# Altium project PCB_Project.PrjPcb
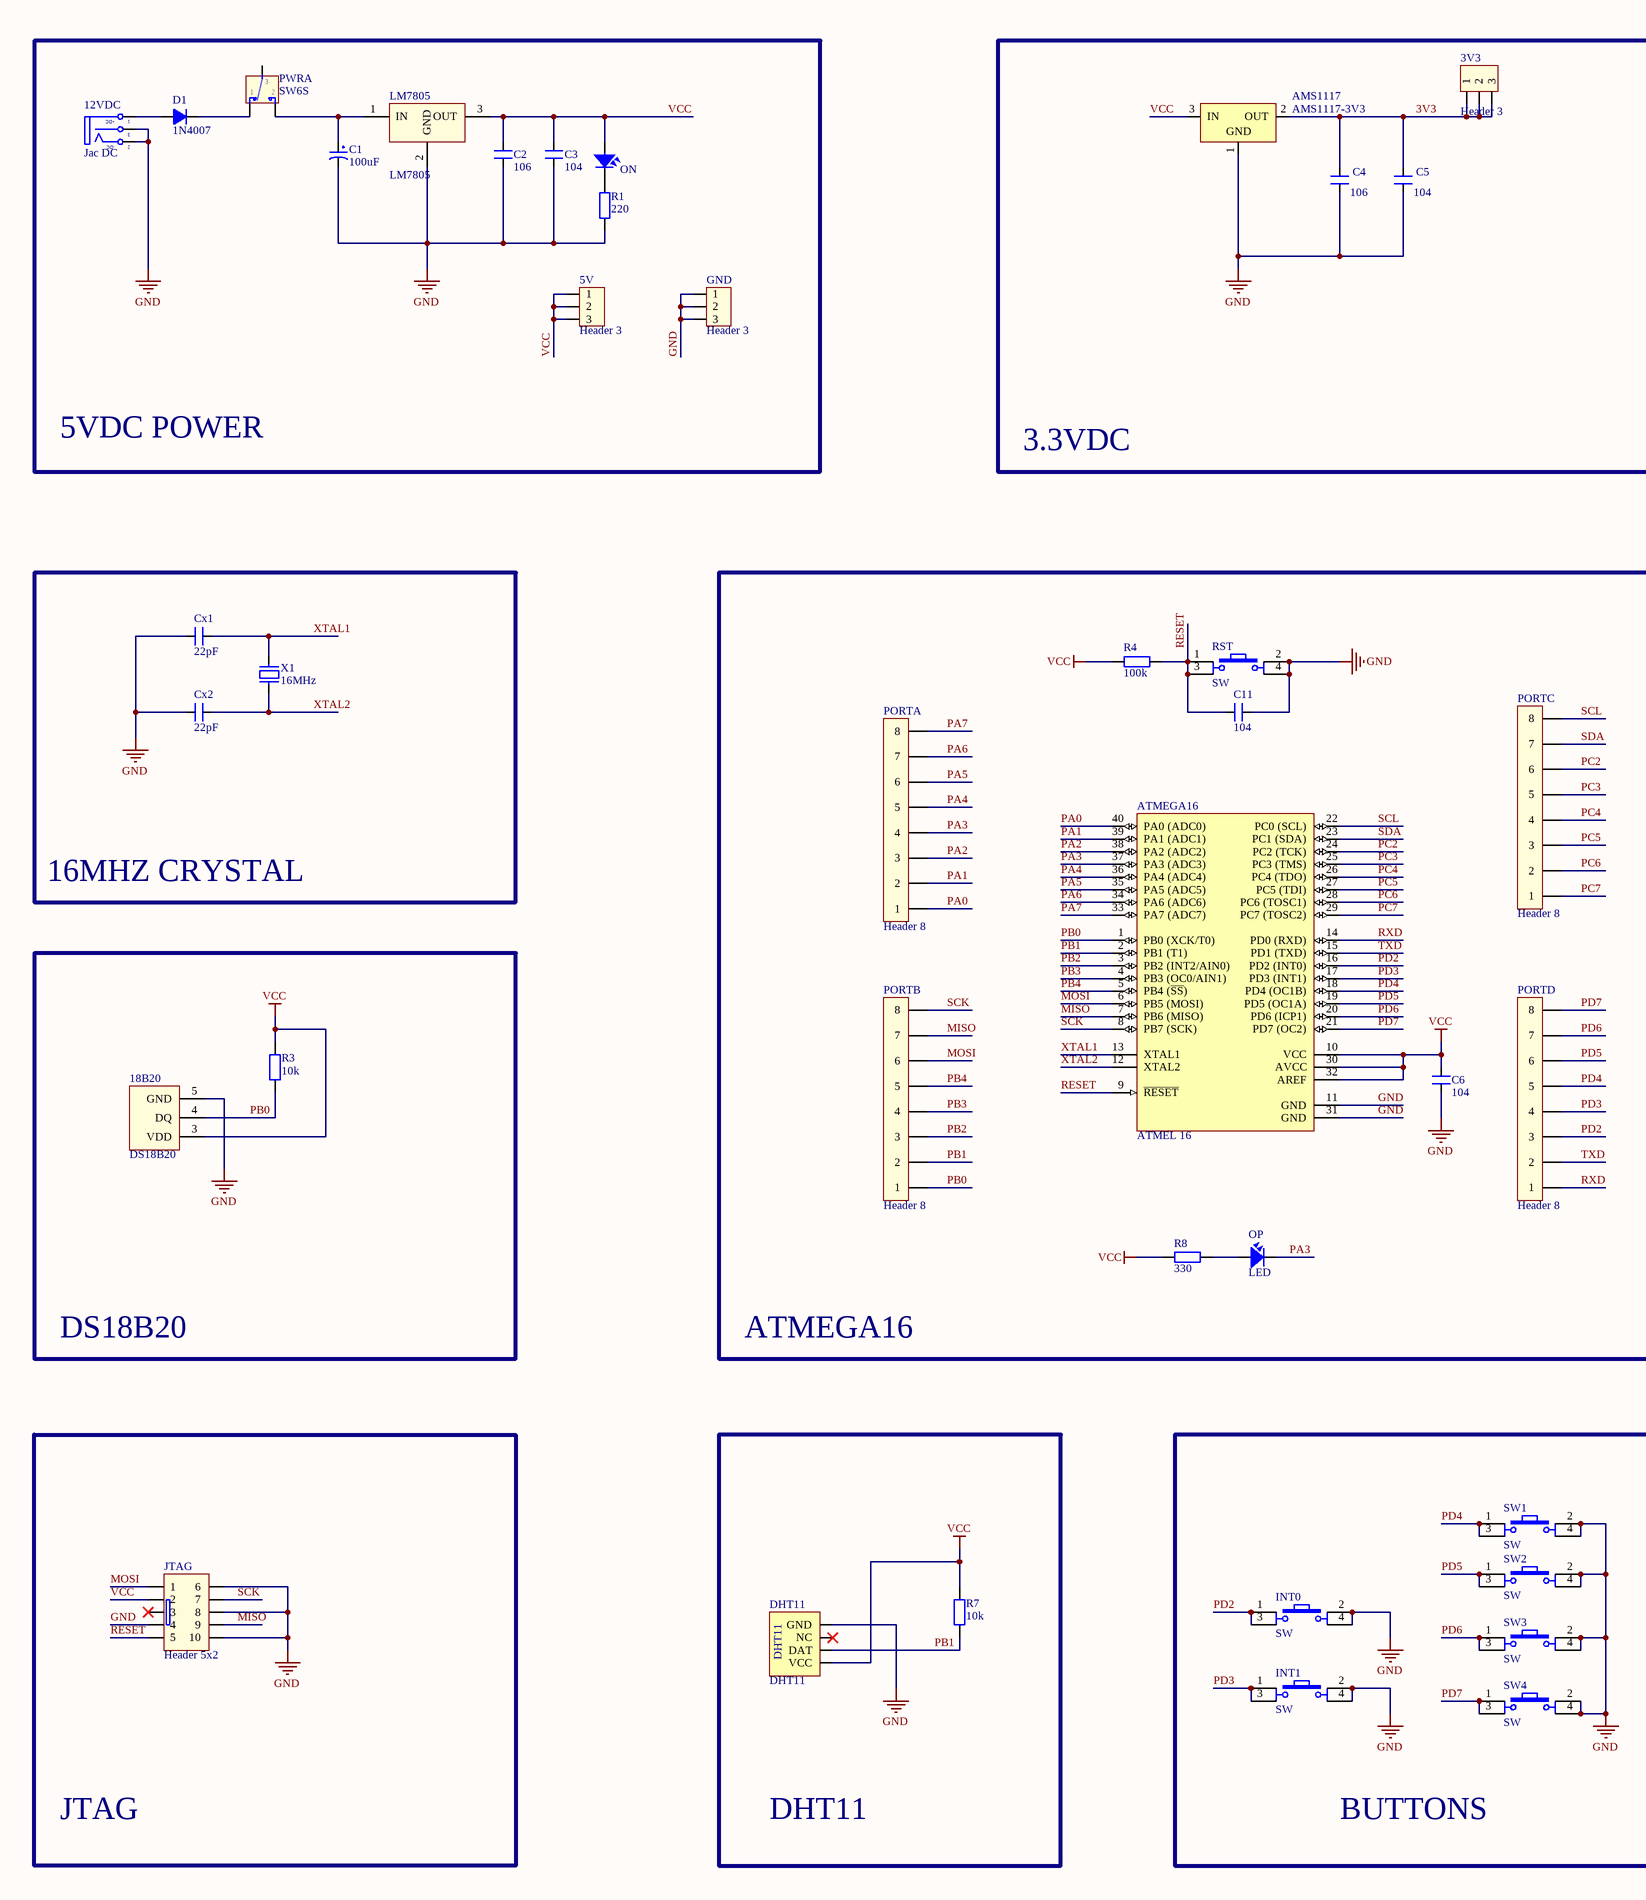
[diagram p0: Schematic.SchDoc, left]
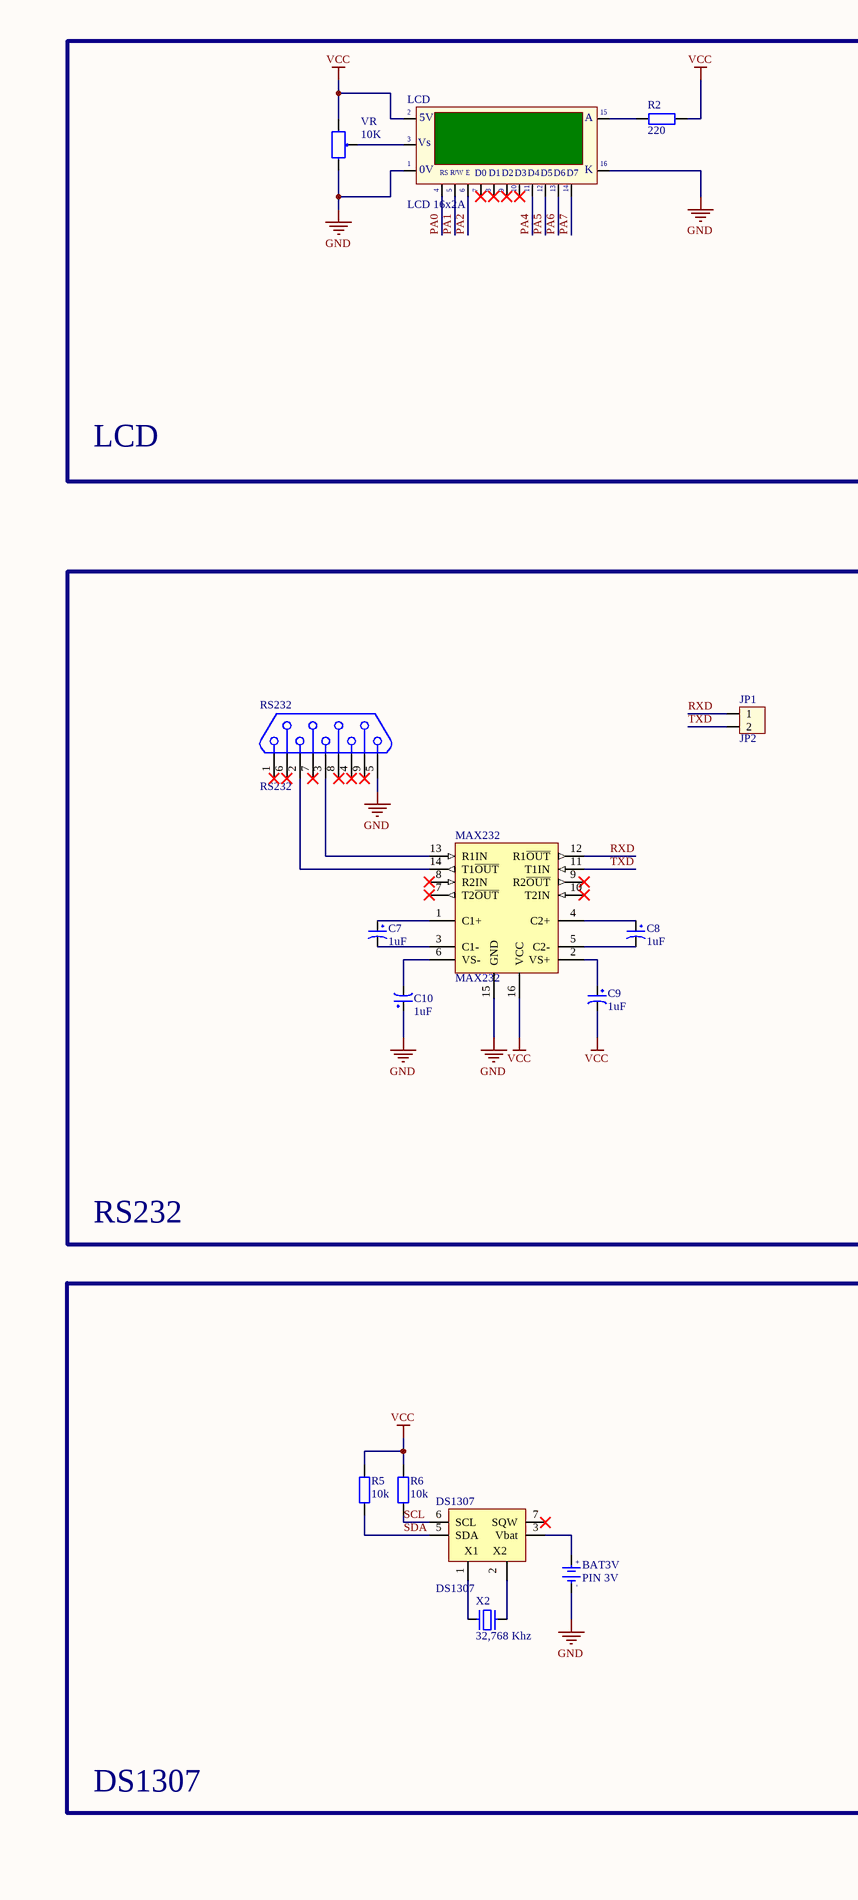
[diagram p1: Schematic.SchDoc, right]
1 sheet, 55 parts. Net scope: global (net labels, ports and power ports of the same name join across sheets).
Board file: Layout.PcbDoc

## Sheet Schematic.SchDoc
size A2

### Parts
3V3  Header 3  [HDR1X3]
5V  Header 3  [HDR1X3]
12VDC  Jac DC  [DC-IN]
18B20  DS18B20  [DS18S20]
AMS1117  AMS1117-3V3  [AMS1117-3.3V]
ATMEGA16  ATMEL 16  [DIP40/W0.6]
BAT3V  PIN 3V  [PIN3V]
C1  100uF  [CP1/2]
C2  106  [CN2]
C3  104  [CN2]
C4  106  [CN2]
C5  104  [CN2]
C6  104  [CN2]
C7  1uF  [CP1/2]
C8  1uF  [CP1/2]
C9  1uF  [CP1/2]
C10  1uF  [CP1/2]
C11  104  [CN2]
Cx1  22pF  [CN1]
Cx2  22pF  [CN1]
D1  1N4007  [D1A]
DHT11  DHT11  [JP4-C1T]
DS1307  DS1307  [DIP8/W0.3]
GND  Header 3  [HDR1X3]
INT0  SW  [SW4]
INT1  SW  [SW4]
JP1  JP2  [CON2]
JTAG  Header 5x2  [Hed2X5]
LCD  LCD 16x2A  [LCD16x2]
LM7805  LM7805  [QTO-220]
MAX232  MAX232  [DIP16/W0.3]
ON  LED  [LED-3]  (value not drawn)
OP  LED  [LED-3]
PORTA  Header 8  [HDR1X8]
PORTB  Header 8  [HDR1X8]
PORTC  Header 8  [HDR1X8]
PORTD  Header 8  [HDR1X8]
PWR  SW6S  [SW6]  (part A of 2)
R1  220  [R1/4W]
R2  220  [R1/4W]
R3  10k  [R1/4W]
R4  100k  [R1/4W]
R5  10k  [R1/4W]
R6  10k  [R1/4W]
R7  10k  [R1/4W]
R8  330  [R1/4W]
RS232  RS232  [DSB 9-F]
RST  SW  [SW4]
SW1  SW  [SW4]
SW2  SW  [SW4]
SW3  SW  [SW4]
SW4  SW  [SW4]
VR  10K  [VR1]
X1  16MHz  [XT2]
X2  32,768 Khz  [XT32-2]

### Blocks framed on the sheet
5VDC POWER: 5V 12VDC C1-C3 D1 GND LM7805 ON PWR R1
3.3VDC: 3V3 AMS1117 C4 C5
LCD: LCD R2 VR
16MHZ CRYSTAL: Cx1 Cx2 X1
ATMEGA16: ATMEGA16 C6 C11 OP PORTA PORTB PORTC PORTD R4 R8 RST
RS232: C7-C10 JP1 MAX232 RS232
DS18B20: 18B20 R3
DS1307: BAT3V DS1307 R5 R6 X2
JTAG: JTAG
DHT11: DHT11 R7
BUTTONS: INT0 INT1 SW1-SW4

### Nets
GND: 12VDC.2(TN) 12VDC.3(S) 18B20.5(GND) AMS1117.1(GND) ATMEGA16.11(GND) ATMEGA16.31(GND) BAT3V.2(GND) C1.2 C2.1 C3.1 C4.1 C5.1 C6.1 C10.1 C11.2 Cx1.1 Cx2.1 DHT11.4(GND) DS1307.4(GND) GND.1 GND.2 GND.3 INT0.2 INT0.4 INT1.2 INT1.4 JTAG.4 JTAG.6 JTAG.8 JTAG.10 LCD.1(GND) LCD.16(K) LM7805.2(GND) MAX232.15(GND) R1.1 RS232.5 RST.2 RST.4 SW1.2 SW1.4 SW2.2 SW2.4 SW3.2 SW3.4 SW4.2 SW4.4 VR.3
VCC: 5V.1 5V.2 5V.3 18B20.3(VDD) AMS1117.3(IN) ATMEGA16.10(VCC) ATMEGA16.30(AVCC) ATMEGA16.32(AREF) C2.2 C3.2 C6.2 C9.2 DHT11.1(VCC) DS1307.8(VCC) JTAG.2 LCD.2(VDD) LM7805.3(OUT) MAX232.16(VCC) ON.1 R2.2 R3.2 R4.1 R5.2 R6.2 R7.2 R8.1 VR.1
3V3: 3V3.1 3V3.2 3V3.3 AMS1117.2(OUT) C4.2 C5.2
MISO: ATMEGA16.7(PB6_(MISO)) JTAG.9 PORTB.7
MOSI: ATMEGA16.6(PB5_(MOSI)) JTAG.1 PORTB.6
PA0: ATMEGA16.40(PA0_(ADC0)) LCD.4(RS) PORTA.1
PA1: ATMEGA16.39(PA1_(ADC1)) LCD.5(R/~{W}) PORTA.2
PA2: ATMEGA16.38(PA2_(ADC2)) LCD.6(~{EN}) PORTA.3
PA3: ATMEGA16.37(PA3_(ADC3)) OP.2 PORTA.4
PA4: ATMEGA16.36(PA4_(ADC4)) LCD.11(D4) PORTA.5
PA5: ATMEGA16.35(PA5_(ADC5)) LCD.12(D5) PORTA.6
PA6: ATMEGA16.34(PA6_(ADC6)) LCD.13(D6) PORTA.7
PA7: ATMEGA16.33(PA7_(ADC7)) LCD.14(D7) PORTA.8
PB0: 18B20.4(DQ) ATMEGA16.1(PB0_(XCK/T0)) PORTB.1 R3.1
PB1: ATMEGA16.2(PB1_(T1)) DHT11.2(DAT) PORTB.2 R7.1
PB2: ATMEGA16.3(PB2_(INT2/AIN0)) PORTB.3
PB3: ATMEGA16.4(PB3_(OC0/AIN1)) PORTB.4
PB4: ATMEGA16.5(PB4_(~{SS})) PORTB.5
PC2: ATMEGA16.24(PC2_(TCK)) PORTC.6
PC3: ATMEGA16.25(PC3_(TMS)) PORTC.5
PC4: ATMEGA16.26(PC4_(TDO)) PORTC.4
PC5: ATMEGA16.27(PC5_(TDI)) PORTC.3
PC6: ATMEGA16.28(PC6_(TOSC1)) PORTC.2
PC7: ATMEGA16.29(PC7_(TOSC2)) PORTC.1
PD2: ATMEGA16.16(PD2_(INT0)) INT0.1 INT0.3 PORTD.3
PD3: ATMEGA16.17(PD3_(INT1)) INT1.1 INT1.3 PORTD.4
PD4: ATMEGA16.18(PD4_(OC1B)) PORTD.5 SW1.1 SW1.3
PD5: ATMEGA16.19(PD5_(OC1A)) PORTD.6 SW2.1 SW2.3
PD6: ATMEGA16.20(PD6_(ICP1)) PORTD.7 SW3.1 SW3.3
PD7: ATMEGA16.21(PD7_(OC2)) PORTD.8 SW4.1 SW4.3
RESET: ATMEGA16.9(~{RESET}) C11.1 JTAG.5 R4.2 RST.1 RST.3
RXD: ATMEGA16.14(PD0_(RXD)) JP1.1 MAX232.12(R1~{OUT}) PORTD.1
SCK: ATMEGA16.8(PB7_(SCK)) JTAG.7 PORTB.8
SCL: ATMEGA16.22(PC0_(SCL)) DS1307.6(SCL) PORTC.8 R6.1
SDA: ATMEGA16.23(PC1_(SDA)) DS1307.5(SDA) PORTC.7 R5.1
TXD: ATMEGA16.15(PD1_(TXD)) JP1.2 MAX232.11(T1IN) PORTD.2
XTAL1: ATMEGA16.13(XTAL1) Cx1.2 X1.2
XTAL2: ATMEGA16.12(XTAL2) Cx2.2 X1.1
Net12VDC_1: 12VDC.1(T) D1.1(A)
NetBAT3V_1: BAT3V.1(+3V) DS1307.3(Vbat)
NetC1_1: C1.1 LM7805.1(IN) PWR.2
NetC7_1: C7.1 MAX232.1(C1+)
NetC7_2: C7.2 MAX232.3(C1-)
NetC8_1: C8.1 MAX232.4(C2+)
NetC8_2: C8.2 MAX232.5(C2-)
NetC9_1: C9.1 MAX232.2(VS+)
NetC10_2: C10.2 MAX232.6(VS-)
NetD1_2: D1.2(K) PWR.1
NetDS1307_1: DS1307.1(X1) X2.1
NetDS1307_2: DS1307.2(X2) X2.2
NetLCD_3: LCD.3(VEE) VR.2
NetLCD_15: LCD.15(A) R2.1
NetMAX232_13: MAX232.13(R1IN) RS232.3
NetMAX232_14: MAX232.14(T1~{OUT}) RS232.2
NetON_2: ON.2 R1.2
NetOP_1: OP.1 R8.2

Not connected (* = marked no-connect by the designer): AMS1117 4(OUT); DHT11 3(NC)*; DS1307 7(SQW)*; JTAG 3*; LCD 7(D0)* 8(D1)* 9(D2)* 10(D3)*; MAX232 7(T2~{OUT})* 8(R2IN)* 9(R2~{OUT})* 10(T2IN)*; PWR 3; RS232 1* 4* 6* 7* 8* 9*

### Notes on the sheet
- (in symbol DCIN) +DC; -DC
- (in symbol LCD16x2A) 5V; Vs; |; 0V; R/W; E
- (in symbol PIN 3V) +; -

### Library data of the parts
3V3 5V GND = Hed3: Header 3 (Green); Value: Header 3
12VDC = DCIN: Jac DC input; Value: Jac DC
18B20 = DS18S20: High Precision  1-Wire® Digital Thermometer
AMS1117 = AMS1117-3V3: Linear Voltage Regulator 3.3V 1A 15V Max SOT-223; ComponentLink1Description: Datasheet; ComponentLink1URL: D:\Dropbox\Datasheets\Power Management ICs\Linear Regulators\AMS1117.pdf; Unit Price: 0.2000
ATMEGA16 = ATmega16A-PU: 8-Bit AVR Microcontroller with 16K Bytes of In-System Programmable Flash Memory; Value: Atmega 16L
BAT3V = PIN 3V: Battery 3VDC; Value: PIN 3V
C1 C7-C10 = CP1: Cap P  0,1uF < 22uF , 16 - 50V; Value: 10uF/50V; Description 1: 10 => 220uF/6,3V/10V - 10uF => 100uF/16V; Description 2: 0,1uF => 33uF/50V - 10uF => 22uF/63V; Description 3: 0,47uF => 10uF/100V
C2-C5 C11 = CN2: Cap np 104 => 105pF; Value: 0.1uF
C6 = CN: Value: 0,1uF/300V; Designed by: VanDungEvn
Cx1 Cx2 = CN0: Cremic For Xtal 1pF => 100pF; Value: 33pF
D1 = D1A: Diode 1A; Value: 1N4007
DHT11 = DHT11: Manufacturer: W¨¹rth Elektronik eiSos GmbH; partNo: 613004143121; ComponentLink1 Description: Manufacturer; ComponentLink2 Description: Datasheet; NoPins: 04; Created Date: 29 March 2013; ComponentLink1URL: http://www.we-online.com; ComponentLink2URL: http://katalog.we-online.de/em/datasheet/6130xx143121.pdf; Created by: Karrer Zheng
DS1307 = DS1307: Real Timer Serial; Value: DS1307
INT0 INT1 RST SW1-SW4 = SW4: Switch button 4 pin; Value: Button chip 4 pin
JP1 = Con2: Connector 2; Value: Connector 2
JTAG = HED5x2: Value: Header 5x2
LCD = LCD16x2A: LCD dipslay 16 char, 2 line; Value: LCD16x2A
LM7805 = LM78xx: On ap +, from + 5 to + 24VDC; Value: LM7805
MAX232 = MAX232: Dual EIA-232 Driver/Receiver; Value: MAX232
ON OP = LED: LED Single colour Green and Red; Value: LED 3 ly Single Colour
PORTA PORTB PORTC PORTD = HED8V: Header 8 Vit Broad
PWR = SW6S: SW-DTDP - 6 Pin; Value: SW6
R1-R8 = R1/4W: Resistor 1/4W; Value: R1/4W - 1K
RS232 = COM
VR = VR: Var Resistor; Value: VR 10K
X1 = XT2: Crystal For all Crystal 2pin.; Value: 4Mhz
X2 = XT32k: Crystal 32,768kHz for timer real; Value: 32,768khz